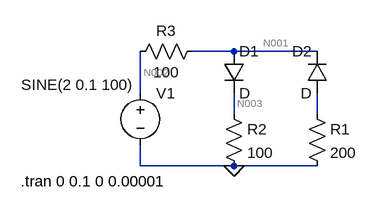
[diagram p0: schematic ACE_Q_37.asc]
ACE_Q_37.asc, the LTspice schematic file:
Version 4
SHEET 1 880 680
WIRE 176 80 112 80
WIRE 304 80 176 80
WIRE 32 144 32 80
WIRE 176 176 176 144
WIRE 304 176 304 144
WIRE 32 256 32 224
WIRE 176 256 32 256
WIRE 304 256 176 256
FLAG 176 256 0
SYMBOL diode 160 80 R0
SYMATTR InstName D1
SYMBOL diode 320 144 R180
WINDOW 0 24 64 Left 2
WINDOW 3 24 0 Left 2
SYMATTR InstName D2
SYMBOL res 288 160 R0
SYMATTR InstName R1
SYMATTR Value 200
SYMBOL res 160 160 R0
SYMATTR InstName R2
SYMATTR Value 100
SYMBOL res 128 64 R90
WINDOW 0 0 56 VBottom 2
WINDOW 3 32 56 VTop 2
SYMATTR InstName R3
SYMATTR Value 100
SYMBOL voltage 32 128 R0
WINDOW 3 -183 3 Left 2
WINDOW 123 0 0 Left 2
WINDOW 39 0 0 Left 2
SYMATTR InstName V1
SYMATTR Value SINE(2 0.1 100)
TEXT -152 280 Left 2 !.tran 0 0.1 0 0.00001

The netlist it stands for:
* ACE_Q_37.asc
D1 N001 N003 D
D2 N004 N001 D
R1 N004 0 200
R2 N003 0 100
R3 N001 N002 100
V1 N002 0 SINE(2 0.1 100)
.model D D
.lib standard.dio
.tran 0 0.1 0 0.00001
.backanno
.end

* Results of the author's LTspice run, read from the files saved beside the schematic
* Operating Point, zero values left out:
*   V(n001) = 1.352 V
*   V(n003) = 648.3 mV
*   V(n002) = 2 V
*   I(D2) = -1.362 pA
*   I(D1) = 6.483 mA
*   I(R3) = -6.483 mA
*   I(R2) = 6.483 mA
*   I(R1) = 1.362 pA
*   I(V1) = -6.483 mA
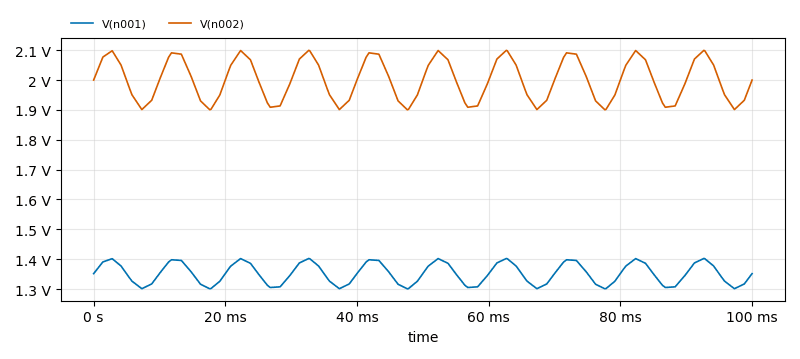
[diagram p1: Transient Analysis of ACE_Q_37.asc, plotted from the saved traces]
* Transient Analysis, 1 run:
*   V(n001): min 1.301 V, max 1.402 V, average 1.352 V, rms 1.352 V, last 1.352 V
*   V(n002): min 1.9 V, max 2.099 V, average 2 V, rms 2.001 V, last 2 V